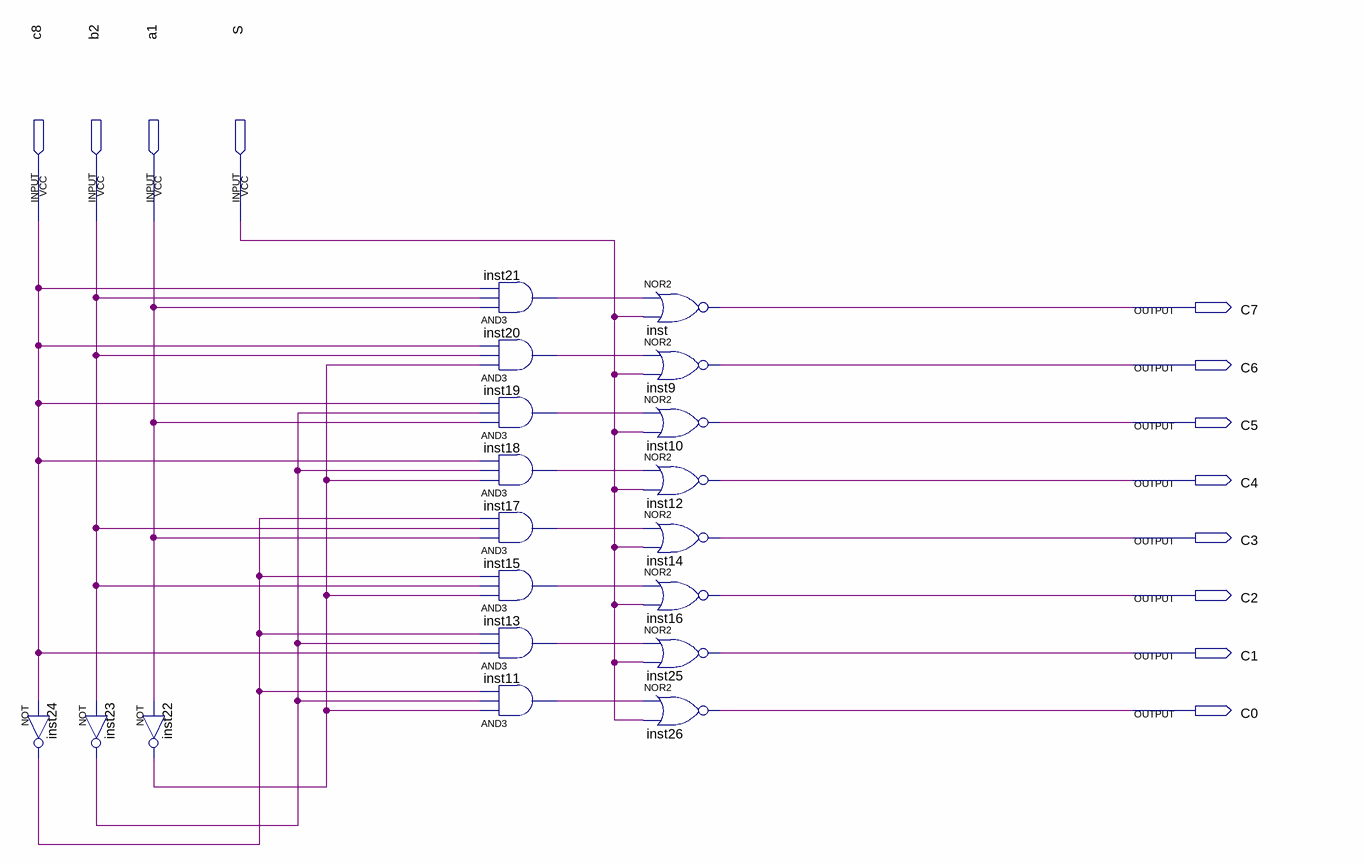
[diagram p0: schematic sheet]
// Quartus schematic trans3to8.bdf as structural Verilog: 19 symbols, 12 pins
module trans3to8 (
  input  c8,
  input  b2,
  input  a1,
  input  S,
  output C7,
  output C6,
  output C5,
  output C4,
  output C3,
  output C2,
  output C1,
  output C0
);

  wire inst11_out, inst13_out, inst15_out, inst17_out, inst18_out, inst19_out, inst20_out, inst21_out,
       inst22_out, inst23_out, inst24_out;

  not inst24 (inst24_out, c8);
  not inst23 (inst23_out, b2);
  not inst22 (inst22_out, a1);
  and inst21 (inst21_out, a1, b2, c8);
  and inst20 (inst20_out, inst22_out, b2, c8);
  and inst19 (inst19_out, a1, inst23_out, c8);
  and inst18 (inst18_out, inst22_out, inst23_out, c8);
  and inst17 (inst17_out, a1, b2, inst24_out);
  and inst15 (inst15_out, inst22_out, b2, inst24_out);
  and inst13 (inst13_out, c8, inst23_out, inst24_out);
  and inst11 (inst11_out, inst22_out, inst23_out, inst24_out);
  nor inst (C7, inst21_out, S);
  nor inst9 (C6, inst20_out, S);
  nor inst10 (C5, inst19_out, S);
  nor inst12 (C4, inst18_out, S);
  nor inst14 (C3, inst17_out, S);
  nor inst16 (C2, inst15_out, S);
  nor inst25 (C1, inst13_out, S);
  nor inst26 (C0, inst11_out, S);
endmodule
